# EAGLE schematic STM32F0 (EAGLE 7.7.0)
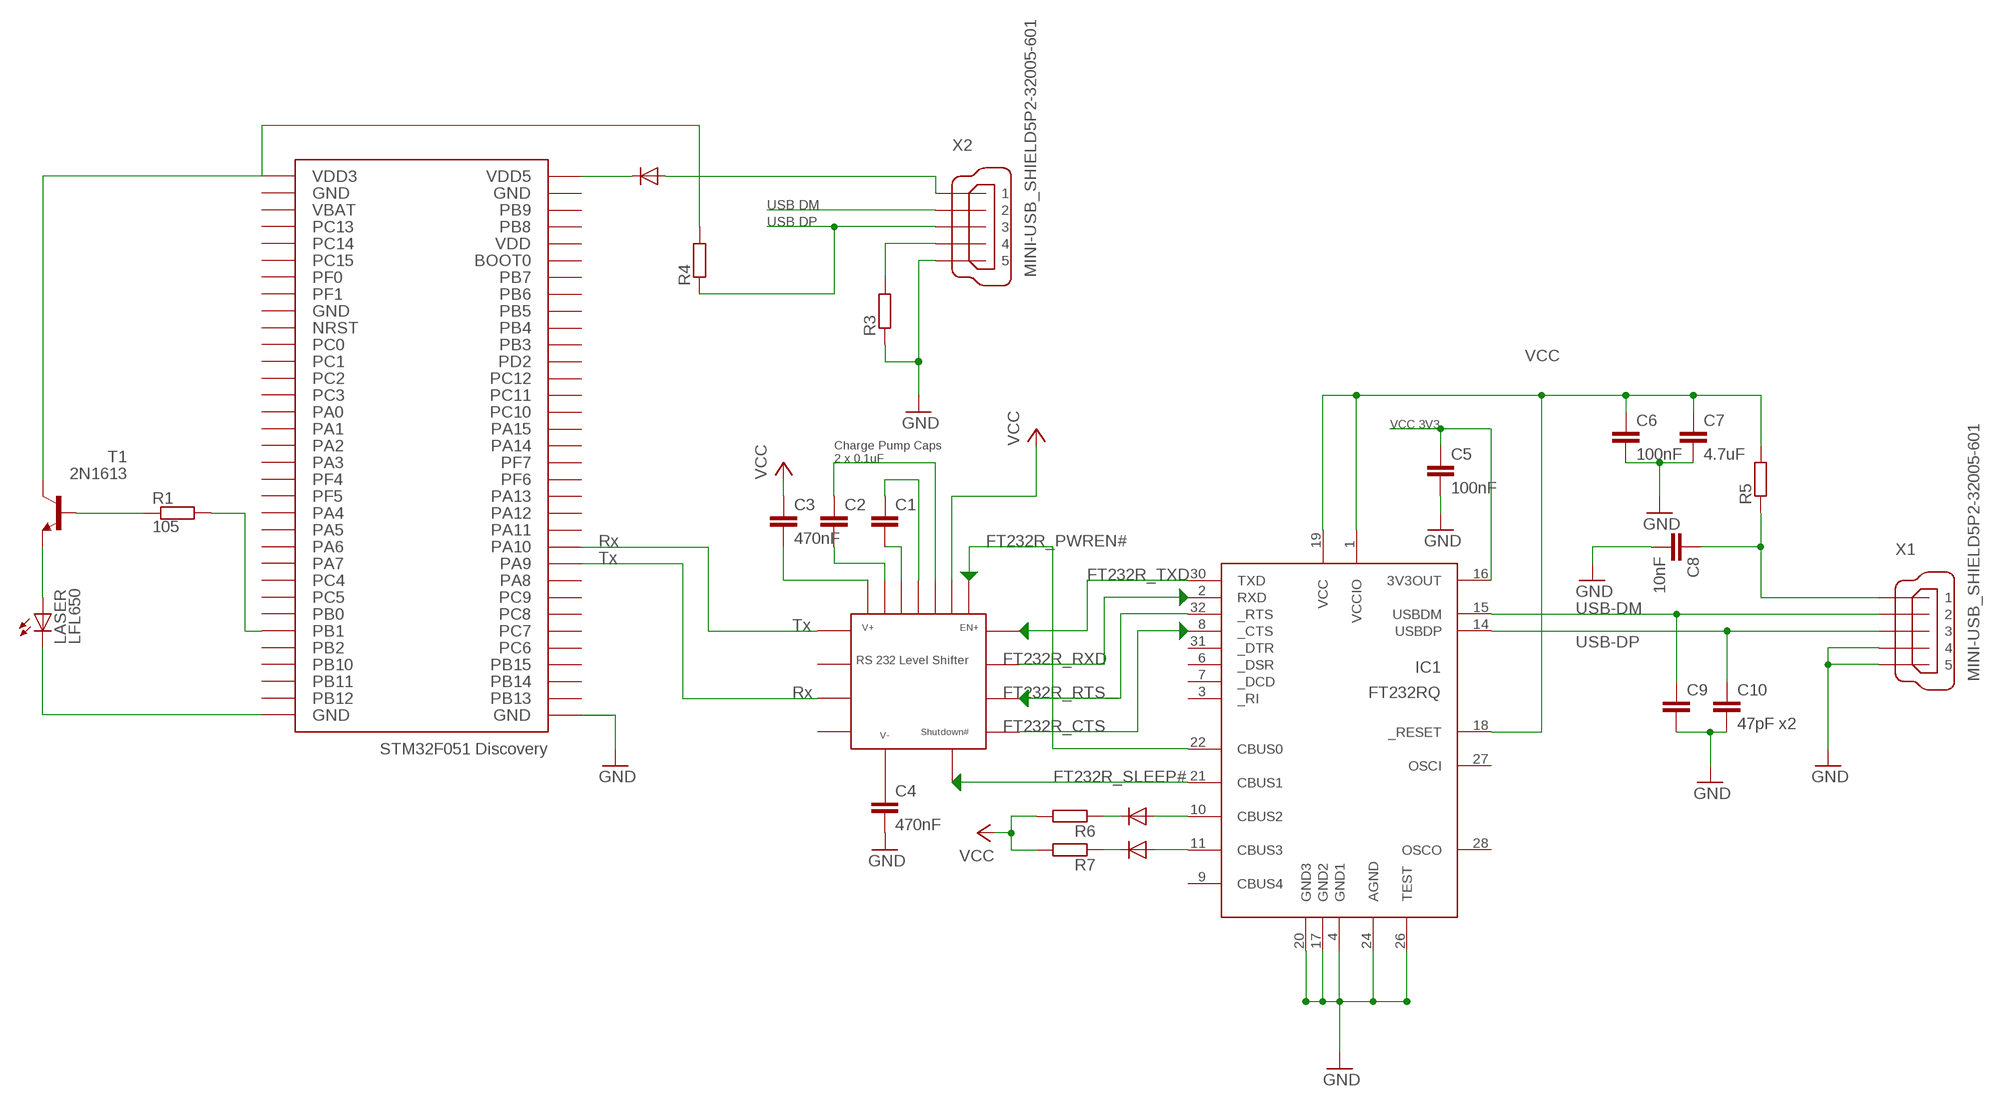
[diagram p0: schematic, sheet 1]

## Parts
C1  C22/10  [C22.5B10]
C2  C22/10  [C22.5B10]
C3  470nF  C22/10  [C22.5B10]
C4  470nF  C22/10  [C22.5B10]
C5  100nF  C22/10  [C22.5B10]
C6  100nF  C22/10  [C22.5B10]
C7  4.7uF  C22/10  [C22.5B10]
C8  10nF  C22/10  [C22.5B10]
C9  C22/10  [C22.5B10]
C10  47pF x2  C22/10  [C22.5B10]
IC1  FT232RQ  [MLF32]
LASER  LFL650  SFH482  [SFH482]
R1  105  SMK  [SMK]
R3  SMK  [SMK]
R4  SMK  [SMK]
R5  SMK  [SMK]
R6  SMK  [SMK]
R7  SMK  [SMK]
T1  2N1613  [TO5]
U$1  STM32F051  [STM32F051]
U$2  RS232LEVELSHIFTER  [RS232LEVELSHIFTER]
X1  MINI-USB_SHIELD5P2-32005-601  [32005-601]
X2  MINI-USB_SHIELD5P2-32005-601  [32005-601]

## Nets
GND: C4.2 C5.2 C8.2 R3.2 X2.5
N$1: C3.2
N$2: IC1.2(RXD)
N$3: C2.1
N$5: C2.2
N$6: IC1.30(TXD)
N$7: IC1.32(_RTS)
N$8: C1.2
N$9: C1.1
N$11: IC1.8(_CTS)
N$12: IC1.22(CBUS0)
N$13: IC1.21(CBUS1)
N$14: IC1.4(GND1) IC1.17(GND2) IC1.20(GND3) IC1.24(AGND) IC1.26(TEST) ; supply symbol labelled GND
N$15: C6.1 C7.1 IC1.1(VCCIO) IC1.18(_RESET) IC1.19(VCC) R5.1
N$17: LASER.K(C)
N$18: LASER.A T1.1(E)
N$19: R4.1 T1.3(C)
N$20: T1.2(B)
N$21: R3.1 X2.4
N$22: X2.2
N$23: R4.2 X2.3
N$25: X2.1
N$26: C5.1 IC1.16(3V3OUT)
N$27: C6.2 C7.2 ; supply symbol labelled GND
N$28: C8.1 R5.2 X1.1
N$29: C9.1 IC1.15(USBDM) X1.2
N$30: C10.1 IC1.14(USBDP) X1.3
N$31: C9.2 C10.2 ; supply symbol labelled GND
N$32: X1.4 X1.5 ; supply symbol labelled GND
N$35: IC1.10(CBUS2)
N$36: IC1.11(CBUS3)
N$37: R6.2
N$38: R7.2
N$39: R6.1 R7.1 ; supply symbol labelled VCC
N$40: R1.1
N$41: R1.2
VCC: C3.1
Unconnected: C4.1 IC1.3(_RI) IC1.6(_DSR) IC1.7(_DCD) IC1.9(CBUS4) IC1.27(OSCI) IC1.28(OSCO) IC1.31(_DTR) U$1.BOOT0 U$1.GND1 U$1.GND2 U$1.GND3 U$1.GND4 U$1.GND5 U$1.NRST U$1.PA0 U$1.PA1 U$1.PA2 U$1.PA3 U$1.PA4 U$1.PA5 U$1.PA6 U$1.PA7 U$1.PA8 U$1.PA9 U$1.PA10 U$1.PA11 U$1.PA12 U$1.PA13 U$1.PA14 U$1.PA15 U$1.PB0 U$1.PB1 U$1.PB2 U$1.PB3 U$1.PB4 U$1.PB5 U$1.PB6 U$1.PB7 U$1.PB8 U$1.PB9 U$1.PB10 U$1.PB11 U$1.PB12 U$1.PB13 U$1.PB14 U$1.PB15 U$1.PC0 U$1.PC1 U$1.PC2 U$1.PC3 U$1.PC4 U$1.PC5 U$1.PC6 U$1.PC7 U$1.PC8 U$1.PC9 U$1.PC10 U$1.PC11 U$1.PC12 U$1.PC13 U$1.PC14 U$1.PC15 U$1.PD2 U$1.PF0 U$1.PF1 U$1.PF4 U$1.PF5 U$1.PF6 U$1.PF7 U$1.VBAT U$1.VDD U$1.VDD3 U$1.VDD5 U$2.P$1 U$2.P$2 U$2.P$3 U$2.P$4 U$2.P$5 U$2.P$6 U$2.P$7 U$2.P$8 U$2.P$9 U$2.P$10 U$2.P$11 U$2.P$12 U$2.P$13 U$2.P$14 U$2.P$15 U$2.P$16 U$2.P$17 X1.M1(S1) X1.M2(S2) X2.M1(S1) X2.M2(S2)

## Notes on the sheet
- USB DM
- USB DP
- VCC
- VCC 3V3
- Charge Pump Caps 
  2 x 0.1uF
- Rx | FT232R_PWREN#
- Tx
- FT232R_TXD
- USB-DM
- Tx
- USB-DP
- FT232R_RXD
- Rx | FT232R_RTS
- FT232R_CTS
- FT232R_SLEEP#

## Library data of the parts
C1-C10 = capacitor-wima:C: CAPACITOR naming: grid - package width
IC1 = ftdichip-3:FT232RQ: USB UART 4th Generation USB UART (USB <-> Serial) Controller
LASER = led:SFH482: IR LED infrared emitting diode, Infineon
R1 R3-R7 = resistor-shunt:SMK: SMD SHUNT RESISTOR; OC_FARNELL: unknown; OC_NEWARK: unknown
T1 = transistor:2N1613: NPN TRANSISTOR
U$1 = STM32F0:STM32F051
U$2 = RS232 Level Shifter:RS232LEVELSHIFTER
X1 X2 = con-cypressindustries:MINI-USB_SHIELD5P2-: MINI USB-B R/A DIP 5pol. Source: www.cypressindustries.com; OC_FARNELL: unknown; OC_NEWARK: unknown